# Altium schematic sheet SmartDevice.SchDoc
size A
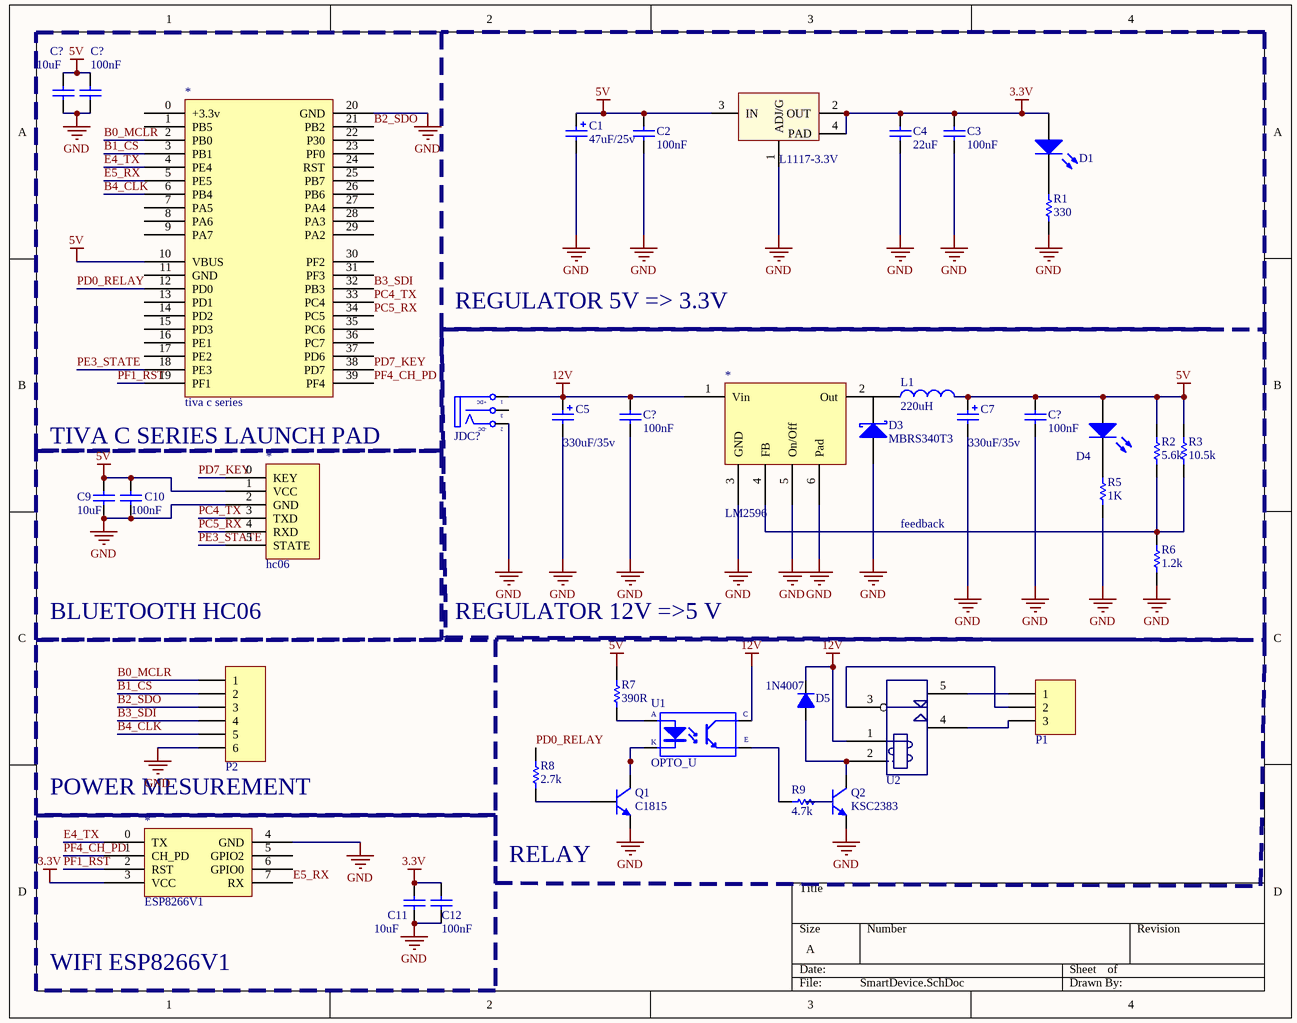
[diagram p0: SmartDevice.SchDoc]

## Parts
(Parts that share a designator on the sheet are numbered #1, #2 ... from top to bottom, then left to right.)
*#1  tiva c series  [TIVA C]
*#2  LM2596
*#3  hc06  [PCBComponent_1]
*#4  ESP8266V1  [ESP8266V1]
C1  value 47uF/25v  [CAP ALU SIZE D]  (hidden comment: Cap Pol SMD)
C2  value 100nF  [CAP-SM-0805]  (hidden comment: Cap Non-Pol SMD)
C3  value 100nF  [CAP-SM-0805]  (hidden comment: Cap Non-Pol SMD)
C4  value 22uF  [CAP-SM-0805]  (hidden comment: Cap Non-Pol SMD)
C5  value 330uF/35v  [CAP ALU SIZE G]  (hidden comment: Cap Pol SMD)
C7  value 330uF/35v  [CAP ALU SIZE G]  (hidden comment: Cap Pol SMD)
C9  value 10uF  [CAP-SM-0805]  (hidden comment: Cap Non-Pol SMD)
C10  value 100nF  [CAP-SM-0805]  (hidden comment: Cap Non-Pol SMD)
C11  value 10uF  [CAP-SM-0805]  (hidden comment: Cap Non-Pol SMD)
C12  value 100nF  [CAP-SM-0805]  (hidden comment: Cap Non-Pol SMD)
C?#1  value 10uF  [CAP-SM-0805]  (hidden comment: Cap Non-Pol SMD)
C?#2  value 100nF  [CAP-SM-0805]  (hidden comment: Cap Non-Pol SMD)
C?#3  value 100nF  [CAP-SM-0805]  (hidden comment: Cap Non-Pol SMD)
C?#4  value 100nF  [CAP-SM-0805]  (hidden comment: Cap Non-Pol SMD)
D1  LED SMD  [LED_0805_Blue]  (value not drawn)
D3  MBRS340T3  [SMB]
D4  LED SMD  [LED_0805_Blue]  (value not drawn)
D5  1N4007  [D1A]
JDC?  Jack DC  [DC-IN]  (value not drawn)
L1  value 220uH  [INDUCTOR 12.5x12.5]  (hidden comment: Inductor)
L1117-3.3V  LM1117  [SOT223-4N]  (value not drawn)
P1  Domino 3H  [DOMINO 3 - 5mm-H]  (value not drawn)
P2  Header 6  [JP6]  (value not drawn)
Q1  C1815  [TO-92A]
Q2  KSC2383  [TO-92A]
R1  value 330  [RES-SM-0805]  (hidden comment: RESISTOR SMD)
R2  value 5.6k  [RES-SM-0805]  (hidden comment: RESISTOR SMD)
R3  value 10.5k  [RES-SM-0805]  (hidden comment: RESISTOR SMD)
R5  value 1K  [RES-SM-0805]  (hidden comment: RESISTOR SMD)
R6  value 1.2k  [RES-SM-0805]  (hidden comment: RESISTOR SMD)
R7  value 390R  [RES-SM-0805]  (hidden comment: RESISTOR SMD)
R8  value 2.7k  [RES-SM-0805]  (hidden comment: RESISTOR SMD)
R9  value 4.7k  [RES-SM-0805]  (hidden comment: RESISTOR SMD)
U1  OPTO_U  [OPTO_U]
U2  RELAY  [RL_SPDT_10A]  (value not drawn)

## Blocks framed on the sheet
TIVA C SERIES LAUNCH PAD: *#1 C?#1 C?#2
REGULATOR 5V => 3.3V: C1-C4 D1 L1117-3.3V R1

## Nets
3.3V: *#4.3(VCC) C3.2 C4.2 C11.2 C12.2 D1.1(A) L1117-3.3V.2(OUT) L1117-3.3V.4(PAD)
5V: *#1.10(VBUS) *#3.1(VCC) C1.1 C2.2 C7.1 C9.2 C10.2 C?#1.2 C?#2.2 C?#4.2 D4.1(A) L1.2 L1117-3.3V.3(IN) R2.2 R3.2 R7.2
12V: *#2.1(Vin) C5.1 C?#3.2 D5.2(K) JDC?.1(T) U1.C U2.1
GND: *#1.20(GND) *#2.3(GND) *#2.5(On/Off) *#2.6(Pad) *#3.2(GND) *#4.4(GND) C1.2 C2.1 C3.1 C4.1 C5.2 C7.2 C9.1 C10.1 C11.1 C12.1 C?#1.1 C?#2.1 C?#3.1 C?#4.1 D3.1(A) JDC?.2(TN) L1117-3.3V.1(ADJ/G) P2.6 R1.1 R5.2 R6.1
B0_MCLR: *#1.2(PB0) P2.1
B1_CS: *#1.3(PB1) P2.2
B2_SDO: *#1.21(PB2) P2.3
B3_SDI: *#1.32(PB3) P2.4
B4_CLK: *#1.6(PB4) P2.5
E4_TX: *#1.4(PE4) *#4.0(TX)
E5_RX: *#1.5(PE5) *#4.7(RX)
PC4_TX: *#1.33(PC4) *#3.3(TXD)
PC5_RX: *#1.34(PC5) *#3.4(RXD)
PD0_RELAY: *#1.12(PD0) R8.2
PD7_KEY: *#1.38(PD7) *#3.0(KEY)
PE3_STATE: *#1.18(PE3) *#3.5(STATE)
PF1_RST: *#1.19(PF1) *#4.2(RST)
PF4_CH_PD: *#1.39(PF4) *#4.1(CH_PD)
Net*#2_2: *#2.2(Out) L1.1
Net*#2_4: *#2.4(FB) R2.1 R3.1 R6.2
NetD1_2: D1.2(K) R1.2
NetD4_2: D4.2(K) R5.1
NetD5_1: D5.1(A) Q2.3(C) U2.2
NetP1_1: P1.1 U2.5
NetP1_2: P1.2 U2.3
NetP1_3: P1.3 U2.4
NetQ1_2: Q1.2(B) R8.1
NetQ1_3: Q1.3(C) U1.K
NetQ2_2: Q2.2(B) R9.1
NetR7_1: R7.1 U1.A
NetR9_2: R9.2 U1.E

Not connected (* = marked no-connect by the designer): *#1 0(+3.3v) 1(PB5) 7(PA5) 8(PA6) 9(PA7) 11(GND) 13(PD1) 14(PD2) 15(PD3) 16(PE1) 17(PE2) 22(P30) 23(PF0) 24(RST) 25(PB7) 26(PB6) 27(PA4) 28(PA3) 29(PA2) 30(PF2) 31(PF3) 35(PC6) 36(PC7) 37(PD6); *#4 5(GPIO2) 6(GPIO0); D3 2(K); JDC? 3(S); Q1 1(E); Q2 1(E)

## Notes on the sheet
- feedback
- BLUETOOTH HC06
- REGULATOR 12V =>5 V
- POWER MESUREMENT
- RELAY
- WIFI ESP8266V1
- Labels drawn without touching a wire or pin: GND
- (in symbol Jack DC) +DC; -DC

## Library data of the parts
C1 C5 C7 = Cap Pol SMD: Polarized Capacitor (Radial)
C2-C4 C9-C12 C?#1-C?#4 = Cap Non-Pol SMD: Capacitor
D1 D4 = LED SMD: LED
D3 = D Schottky: Schottky Diode; Published: 8-Jun-2000; LatestRevisionDate: 17-Jul-2002; LatestRevisionNote: Re-released for DXP Platform.; PackageReference: SMB; Publisher: Altium Limited; PackageDescription: DO-214-AA/SMB; 2 C-Bend Leads; Body 5.3 x 3.6 mm, inc. leads (LxW); Code_JEDEC: DO-214-AA
D5 = D1A: Diode 1A; Value: 1N4007
JDC? = Jack DC: Jack DC input; Value: Jac DC
L1117-3.3V = LM1117: Available in 1.8V, 2.5V, 2.85V, 3.3V, 5V, and  Adjustable Versions; Value: LM317
P1 = Domino 3H: Domino 3-Pin, Right Angle; LatestRevisionDate: 17-Jul-2002; LatestRevisionNote: Re-released for DXP Platform.; Publisher: Altium Limited
P2 = Header 6: Header, 6-Pin; LatestRevisionDate: 17-Jul-2002; LatestRevisionNote: Re-released for DXP Platform.; Publisher: Altium Limited
Q1 Q2 = 2N3904: NPN General Purpose Amplifier; Published: 8-Jun-2000; LatestRevisionDate: 15-Jan-2003; LatestRevisionNote: PCB Footprint 'BCY-W3/D4.7' replaced; DatasheetVersion: 1997; PackageVersion: Sep-1998; PackageReference: TO-92A; Publisher: Altium Limited; PackageDescription: TO, Flat Index; 3 In-Line, Axial Leads; Body Dia. 4.5mm; Leads 0.51 x 0.48 mm (max); ComponentLink1Description: Manufacturer Link; ComponentLink1URL: http://www.fairchildsemi.com/; ComponentLink2Description: Datasheet; ComponentLink2URL: http://www.fairchildsemi.com/ds/2N%2F2N3904.pdf
R1-R3 R5-R9 = RESISTOR SMD: Resistor
U1 = OPTO_U: Single Opto; Value: TLP5211
U2 = RELAY: Relay 10A